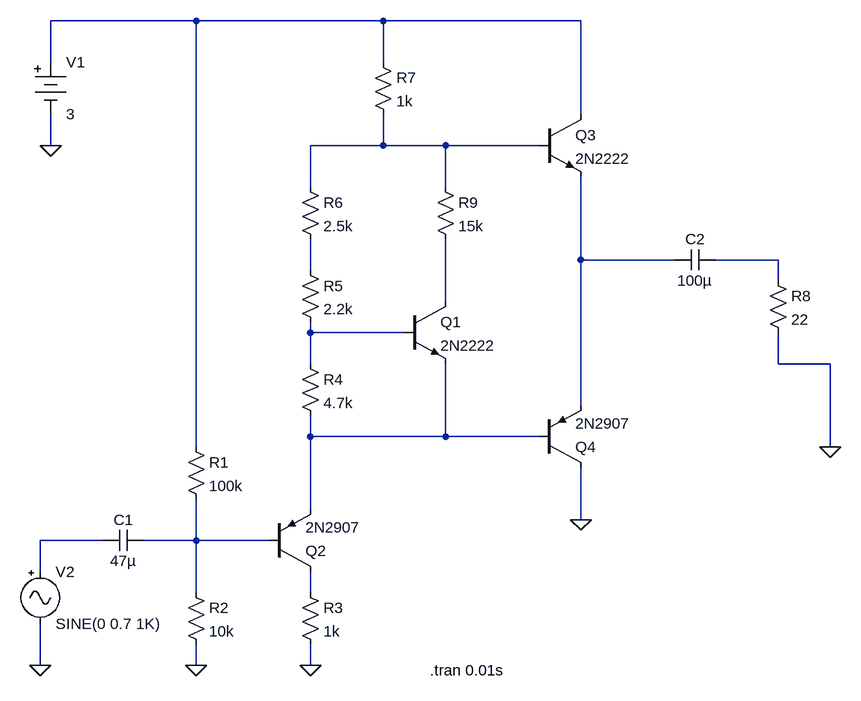
[diagram p0: schematic PowerAmp3.asc]
PowerAmp3.asc, the LTspice schematic file:
Version 4
SHEET 1 976 680
WIRE -64 -448 -288 -448
WIRE 224 -448 -64 -448
WIRE 528 -448 224 -448
WIRE -288 -384 -288 -448
WIRE 224 -384 224 -448
WIRE 528 -304 528 -448
WIRE -288 -256 -288 -304
WIRE 224 -256 224 -304
WIRE 224 -256 112 -256
WIRE 320 -256 224 -256
WIRE 464 -256 320 -256
WIRE 112 -192 112 -256
WIRE 320 -192 320 -256
WIRE 528 -80 528 -208
WIRE 672 -80 528 -80
WIRE 832 -80 736 -80
WIRE 112 -64 112 -112
WIRE 832 -48 832 -80
WIRE 320 -16 320 -112
WIRE 112 32 112 16
WIRE 256 32 112 32
WIRE 112 80 112 32
WIRE 832 80 832 32
WIRE 912 80 832 80
WIRE 528 144 528 -80
WIRE 112 192 112 160
WIRE 320 192 320 80
WIRE 320 192 112 192
WIRE 464 192 320 192
WIRE -64 208 -64 -448
WIRE 912 208 912 80
WIRE 112 304 112 192
WIRE 528 320 528 240
WIRE -208 352 -304 352
WIRE -64 352 -64 288
WIRE -64 352 -144 352
WIRE 48 352 -64 352
WIRE -304 400 -304 352
WIRE -64 432 -64 352
WIRE 112 432 112 400
WIRE -304 544 -304 480
WIRE -64 544 -64 512
WIRE 112 544 112 512
FLAG -304 544 0
FLAG -64 544 0
FLAG -288 -256 0
FLAG 112 544 0
FLAG 528 320 0
FLAG 912 208 0
SYMBOL npn 256 -16 R0
SYMATTR InstName Q1
SYMATTR Value 2N2222
SYMBOL pnp 48 400 M180
SYMATTR InstName Q2
SYMATTR Value 2N2907
SYMBOL res -80 192 R0
SYMATTR InstName R1
SYMATTR Value 100k
SYMBOL cap -144 336 R90
WINDOW 0 0 32 VBottom 2
WINDOW 3 32 32 VTop 2
SYMATTR InstName C1
SYMATTR Value 47µ
SYMBOL res -80 416 R0
SYMATTR InstName R2
SYMATTR Value 10k
SYMBOL battery -288 -400 R0
SYMATTR InstName V1
SYMATTR Value 3
SYMBOL signal -304 384 R0
SYMATTR InstName V2
SYMATTR Value SINE(0 0.7 1K)
SYMBOL res 96 416 R0
SYMATTR InstName R3
SYMATTR Value 1k
SYMBOL res 96 64 R0
SYMATTR InstName R4
SYMATTR Value 4.7k
SYMBOL res 96 -80 R0
SYMATTR InstName R5
SYMATTR Value 2.2k
SYMBOL res 208 -400 R0
SYMATTR InstName R7
SYMATTR Value 1k
SYMBOL npn 464 -304 R0
SYMATTR InstName Q3
SYMATTR Value 2N2222
SYMBOL pnp 464 240 M180
SYMATTR InstName Q4
SYMATTR Value 2N2907
SYMBOL res 816 -64 R0
SYMATTR InstName R8
SYMATTR Value 22
SYMBOL cap 736 -96 R90
WINDOW 0 0 32 VBottom 2
WINDOW 3 32 32 VTop 2
SYMATTR InstName C2
SYMATTR Value 100µ
SYMBOL res 304 -208 R0
SYMATTR InstName R9
SYMATTR Value 15k
SYMBOL res 96 -208 R0
SYMATTR InstName R6
SYMATTR Value 2.5k
TEXT 296 552 Left 2 !.tran 0.01s

The netlist it stands for:
* PowerAmp3.asc
Q1 N006 N007 N008 0 2N2222
Q2 N011 N010 N008 0 2N2907
R1 N001 N010 100k
C1 N010 N009 47µ
R2 N010 0 10k
V1 N001 0 3
V2 N009 0 SINE(0 0.7 1K)
R3 N011 0 1k
R4 N007 N008 4.7k
R5 N005 N007 2.2k
R7 N001 N002 1k
Q3 N001 N002 N003 0 2N2222
Q4 0 N008 N003 0 2N2907
R8 N004 0 22
C2 N004 N003 100µ
R9 N002 N006 15k
R6 N002 N005 2.5k
.model NPN NPN
.model PNP PNP
.lib standard.bjt
.tran 0.01s
.backanno
.end